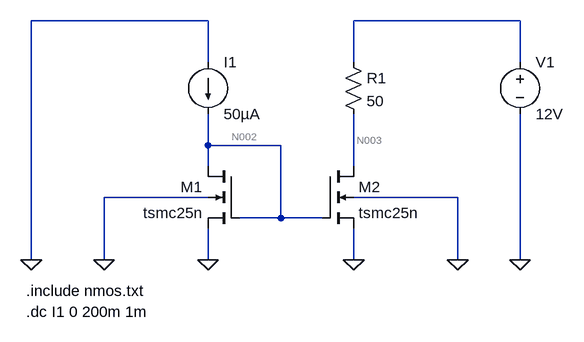
[diagram p0: schematic HW1_SIM_1.asc]
HW1_SIM_1.asc, the LTspice schematic file:
Version 4
SHEET 1 916 680
WIRE 64 -112 -208 -112
WIRE 544 -112 288 -112
WIRE 64 -48 64 -112
WIRE 288 -48 288 -112
WIRE 544 -48 544 -112
WIRE 64 80 64 32
WIRE 176 80 64 80
WIRE 64 112 64 80
WIRE 288 112 288 32
WIRE 64 160 -96 160
WIRE 448 160 288 160
WIRE 176 192 176 80
WIRE 176 192 112 192
WIRE 240 192 176 192
WIRE -208 256 -208 -112
WIRE -96 256 -96 160
WIRE 64 256 64 208
WIRE 288 256 288 208
WIRE 448 256 448 160
WIRE 544 256 544 32
FLAG 64 256 0
FLAG 288 256 0
FLAG 544 256 0
FLAG -208 256 0
FLAG -96 256 0
FLAG 448 256 0
SYMBOL nmos4 240 112 R0
SYMATTR InstName M2
SYMATTR Value tsmc25n
SYMATTR Value2 l=0.18 w=20
SYMBOL nmos4 112 112 M0
SYMATTR InstName M1
SYMATTR Value tsmc25n
SYMATTR Value2 l=0.18 w=20
SYMBOL res 272 -64 R0
SYMATTR InstName R1
SYMATTR Value 50
SYMBOL current 64 -48 R0
WINDOW 123 0 0 Left 0
WINDOW 39 0 0 Left 0
SYMATTR InstName I1
SYMATTR Value 50µA
SYMBOL voltage 544 -64 R0
WINDOW 123 0 0 Left 0
WINDOW 39 0 0 Left 0
SYMATTR InstName V1
SYMATTR Value 12V
TEXT -216 304 Left 2 !.include nmos.txt
TEXT -216 336 Left 2 !.dc I1 0 200m 1m

The netlist it stands for:
* HW1_SIM_1.asc
M2 N003 N002 0 0 tsmc25n l=0.18 w=20
M1 N002 N002 0 0 tsmc25n l=0.18 w=20
R1 N001 N003 50
I1 0 N002 50µA
V1 N001 0 12V
.model NMOS NMOS
.model PMOS PMOS
.lib standard.mos
.include nmos.txt
.dc I1 0 200m 1m
.backanno
.end

* Results of the author's LTspice run, read from the files saved beside the schematic
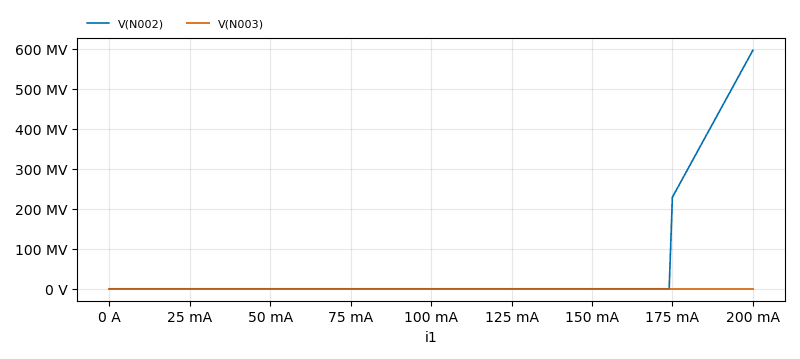
[diagram p1: DC transfer characteristic of HW1_SIM_1.asc, plotted from the saved traces]
* DC transfer characteristic, 1 run:
*   V(N002): 754 fV at i1=0 A, 595.8 MV at i1=200 mA, min 754 fV, max 595.8 MV
*   V(N003): 12 V at i1=0 A, 12 V at i1=200 mA, min 4.894 V, max 12 V